# EAGLE design AC (EAGLE 7.1.0)
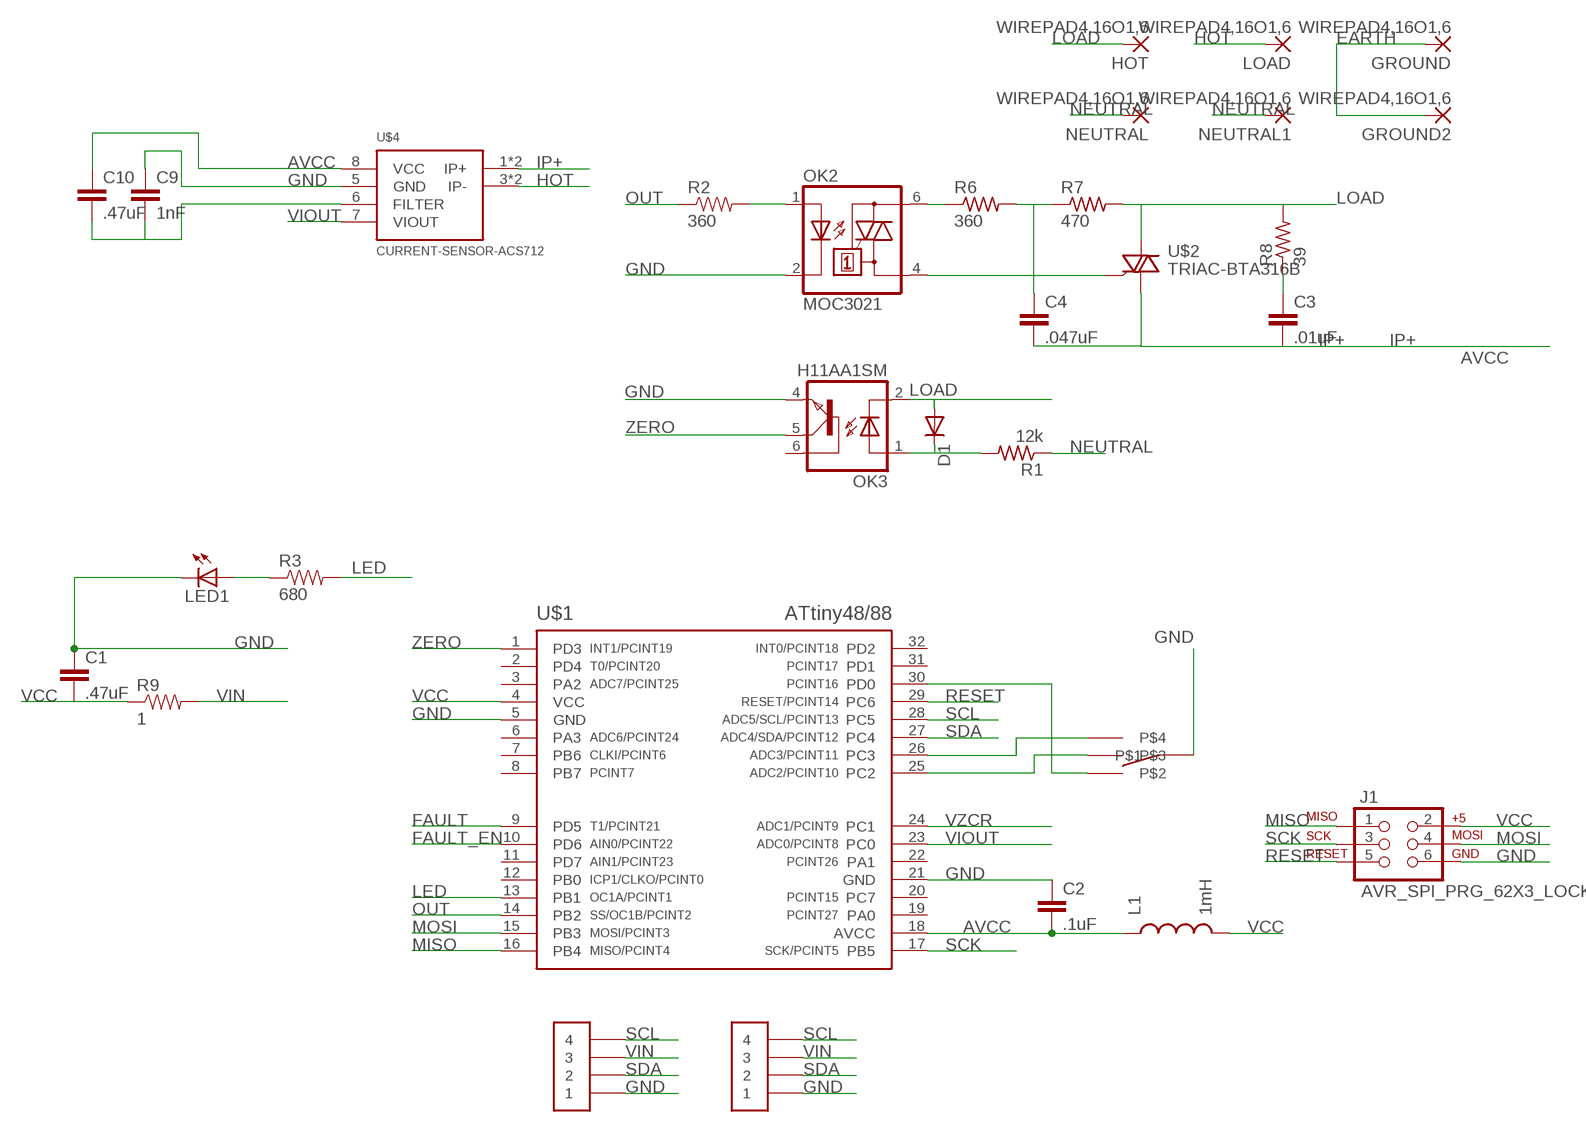
[diagram p0: schematic, sheet 1]

## Parts
C1  .47uF  CAP0805  [0805]
C2  .1uF  CAP0805  [0805]
C3  .01uF  C-EUC1206  [C1206]
C4  .047uF  C-EUC1206  [C1206]
C9  1nF  CAP0805  [0805]
C10  .47uF  CAP0805  [0805]
D1  DIODESMA  [SMA-DIODE]
GROUND  WIREPAD4,16O1,6  [4,16O1,6]
GROUND2  WIREPAD4,16O1,6  [4,16O1,6]
HOT  WIREPAD4,16O1,6  [4,16O1,6]
J1  AVR_SPI_PRG_62X3_LOCK  [2X3_LOCK]
JP1  HEADER-1X4MOLEX-SL  [HEADER-1X4-MOLEX-SL]
JP2  HEADER-1X4MOLEX-SL  [HEADER-1X4-MOLEX-SL]
L1  1mH  INDUCTOR1007  [1007]
LED1  LED5MM  [LED5MM]
LOAD  WIREPAD4,16O1,6  [4,16O1,6]
NEUTRAL  WIREPAD4,16O1,6  [4,16O1,6]
NEUTRAL1  WIREPAD4,16O1,6  [4,16O1,6]
OK2  MOC3021  MOC3031S  [DIL6-SMD]
OK3  H11AA1SM  H11A1SM  [DIL6-SMD]
R1  12k  R-US_R1206  [R1206]
R2  360  RESISTOR0805-RES  [0805]
R3  680  RESISTOR0805-RES  [0805]
R6  360  R-US_R1206  [R1206]
R7  470  R-US_R1206  [R1206]
R8  39  R-US_R1206  [R1206]
R9  1  RESISTOR0805-RES  [0805]
U$1  ATTINY48/88-TQFP  [TQFP-32]
U$2  TRIAC-BTA316B  [D2PACK]
U$3  SWITCH-SP3T  [SWITCH-SLIDE-APEM-MHS133K]
U$4  CURRENT-SENSOR-ACS712  [SOIC-8]

## Nets
AVCC: C2.2 C10.1 L1.1 U$1.18(AVCC) U$4.8(VCC)
EARTH: GROUND2.1(P) GROUND.1(P)
FAULT: U$1.9(PD5)
FAULT_EN: U$1.10(PD6)
GND: C1.1 C2.1 C9.1 J1.6 JP1.P$1 JP2.P$1 LED1.K(C) OK2.2(C) OK3.4(EMI) U$1.5(GND) U$1.21(GND) U$3.P2 U$4.5(GND)
HOT: LOAD.1(P) U$4.3(IP-) U$4.4(IP-)
IP+: C3.2 C4.2 U$2.1(A1) U$4.1(IP+) U$4.2(IP+)
LED: R3.2 U$1.13(PB1)
LOAD: D1.A HOT.1(P) OK3.2(C) R7.2 R8.2 U$2.2(A2)
MISO: J1.1 U$1.16(PB4)
MOSI: J1.4 U$1.15(PB3)
N$1: OK2.4(A1) U$2.3(G)
N$2: D1.C OK3.1(A) R1.2
N$3: OK2.1(A) R2.2
N$4: OK2.6(A2) R6.1
N$5: LED1.A R3.1
N$7: U$1.25(PC2) U$3.P3
N$8: U$1.26(PC3) U$3.P4
N$9: U$1.30(PD0) U$3.P1
N$12: C9.2 C10.2 U$4.6(FILTER)
N$13: C4.1 R6.2 R7.1
N$14: C3.1 R8.1
NEUTRAL: NEUTRAL1.1(P) NEUTRAL.1(P) R1.1
OUT: R2.1 U$1.14(PB2)
RESET: J1.5 U$1.29(PC6)
SCK: J1.3 U$1.17(PB5)
SCL: JP1.P$4 JP2.P$4 U$1.28(PC5)
SDA: JP1.P$2 JP2.P$2 U$1.27(PC4)
VCC: C1.2 J1.2 L1.2 R9.1 U$1.4(VCC)
VIN: JP1.P$3 JP2.P$3 R9.2
VIOUT: U$1.23(PC0) U$4.7(VIOUT)
VZCR: U$1.24(PC1)
ZERO: OK3.5(COL) U$1.1(PD3)
Unconnected: OK3.6(BAS) U$1.2(PD4) U$1.3(PA2) U$1.6(PA3) U$1.7(PB6) U$1.8(PB7) U$1.11(PD7) U$1.12(PB0) U$1.19(PA0) U$1.20(PC7) U$1.22(PA1) U$1.31(PD1) U$1.32(PD2)

## Library data of the parts
C1 C2 C9 C10 = SparkFun-Capacitors:CAP: Capacitor Standard 0603 ceramic capacitor, and 0.1" leaded capacitor.
C3 C4 = resistor:C-EU: CAPACITOR, European symbol; SPICEPREFIX: C
D1 = SparkFun-DiscreteSemi:DIODE: Diode These are standard reverse protection diodes and small signal diodes. SMA package can handle up to about 1A. SOD-323 can handle about 200mA. What the SOD-323 package when ordering, there are some mfgs out there that are 5-pin packages.
GROUND GROUND2 HOT LOAD NEUTRAL NEUTRAL1 = wirepad:WIREPAD: Wire PAD connect wire on PCB
J1 = SparkFun-Connectors:AVR_SPI_PRG_6: AVR ISP 6 Pin This is the reduced ISP connector for AVR programming. Common on Arduino. This footprint will take up less PCB space and can be used with a 10-pin to 6-pin adapter such as SKU: BOB-08508
JP1 JP2 = IntegerLabs:HEADER-1X4
L1 = SparkFun-Passives:INDUCTOR: Inductors Basic Inductor/Choke - 0603 and 1206. Footprints are not proven and vary greatly between part numbers. SRN6045- 33uH, 20% 1.4A SDR0403-560KL - 56uH, 10%, 500mA RMS/740mA peak
LED1 = adafruit:LED: LED OSRAM: - CHIPLED LG R971, LG N971, LY N971, LG Q971, LY Q971, LO R971, LY R971 LH N974, LH R974 LS Q976, LO Q976, LY Q976 LO Q996 - Hyper CHIPLED LW Q18S LB Q993, LB Q99A, LB R99A - SideLED LS A670, LO A670, LY A670, LG A670, LP A670 LB A673, LV A673, LT A673, LW A673 LH A674 LY A675 LS A676, LA A676, LO A676, LY A676, LW A676 LS A679, LY A679, LG A679 - Hyper Micro SIDELED® LS Y876, LA Y876, LO Y876, LY Y876 LT Y87S - SmartLED LW L88C, LW L88S LB L89C, LB L89S, LG L890 LS L89K, LO L89K, LY L89K LS L896, LA L896, LO L896, LY L896 - TOPLED LS T670, LO T670, LY T670, LG T670, LP T670 LSG T670, LSP T670, LSY T670, LOP T670, LYG T670 LG T671, LOG T671, LSG T671 LB T673, LV T673, LT T673, LW T673 LH T674 LS T676, LA T676, LO T676, LY T676, LB T676, LH T676, LSB T676, LW T676 LB T67C, LV T67C, LT T67C, LS T67K, LO T67K, LY T67K, LW E67C LS E67B, LA E67B, LO E67B, LY E67B, LB E67C, LV E67C, LT E67C LW T67C LS T679, LY T679, LG T679 LS T770, LO T770, LY T770, LG T770, LP T770 LB T773, LV T773, LT T773, LW T773 LH T774 LS E675, LA E675, LY E675, LS T675 LS T776, LA T776, LO T776, LY T776, LB T776 LHGB T686 LT T68C, LB T68C - Hyper Mini TOPLED® LB M676 - Mini TOPLED Santana® LG M470 LS M47K, LO M47K, LY M47K Source: http://www.osram.convergy.de/
OK2 = optocoupler:MOC30*: 6-Pin DIP Zero-Cross Optoisolators Triac Driver Output (250/400 Volt Peak) Source: Data sheet <http://www.fairchildsemi.com/ds/MO/MOC3031M.pdf> The old path of data sheet not more available 2013-05-06.; MF: FAIRCHILD SEMICONDUCTOR; MPN: MOC3031SM; OC_FARNELL: unknown; OC_NEWARK: 34C1335
OK3 = optocoupler:H11A*?M: General Purpose 6-Pin Phototransistor Optocouplers Source: http://www.fairchildsemi.com/ds/4N/4N35-M.pdf; OC_FARNELL: unknown; OC_NEWARK: unknown
R1 R6-R8 = resistor:R-US_: RESISTOR, American symbol
R2 R9 = SparkFun-Resistors:RESISTOR: Resistor Basic schematic elements and footprints for 0603, 1206, and PTH resistors.
R3 = SparkFun-Passives:RESISTOR: Resistor Basic schematic elements and footprints for 0603, 1206, and PTH resistors.
U$1 = IntegerLabs:ATTINY48/88
U$2 = IntegerLabs:TRIAC-BTA316B
U$3 = IntegerLabs:SWITCH-SP3T
U$4 = IntegerLabs:CURRENT-SENSOR-ACS712

## Board
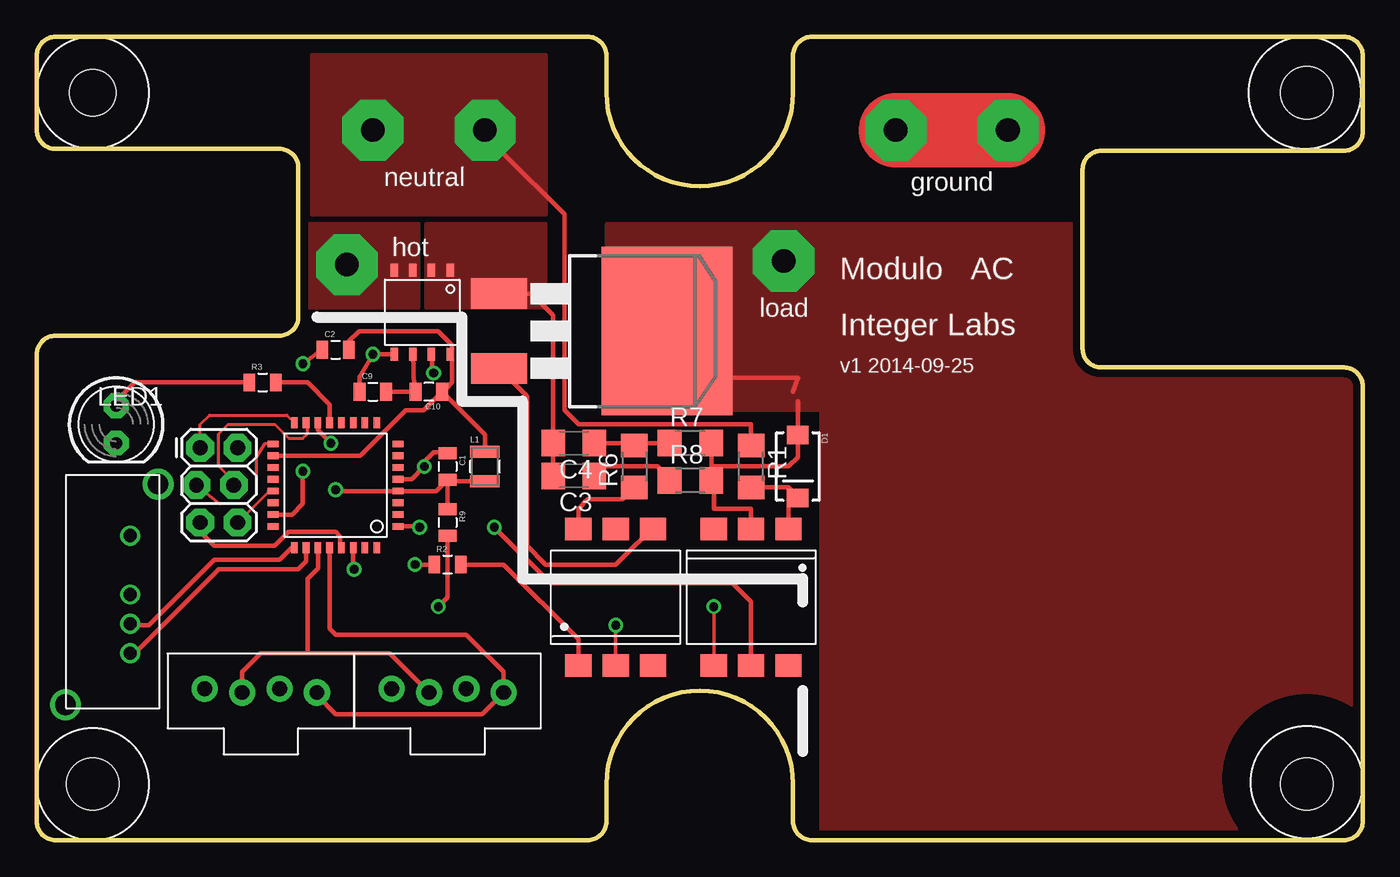
[diagram p1: board, top side]
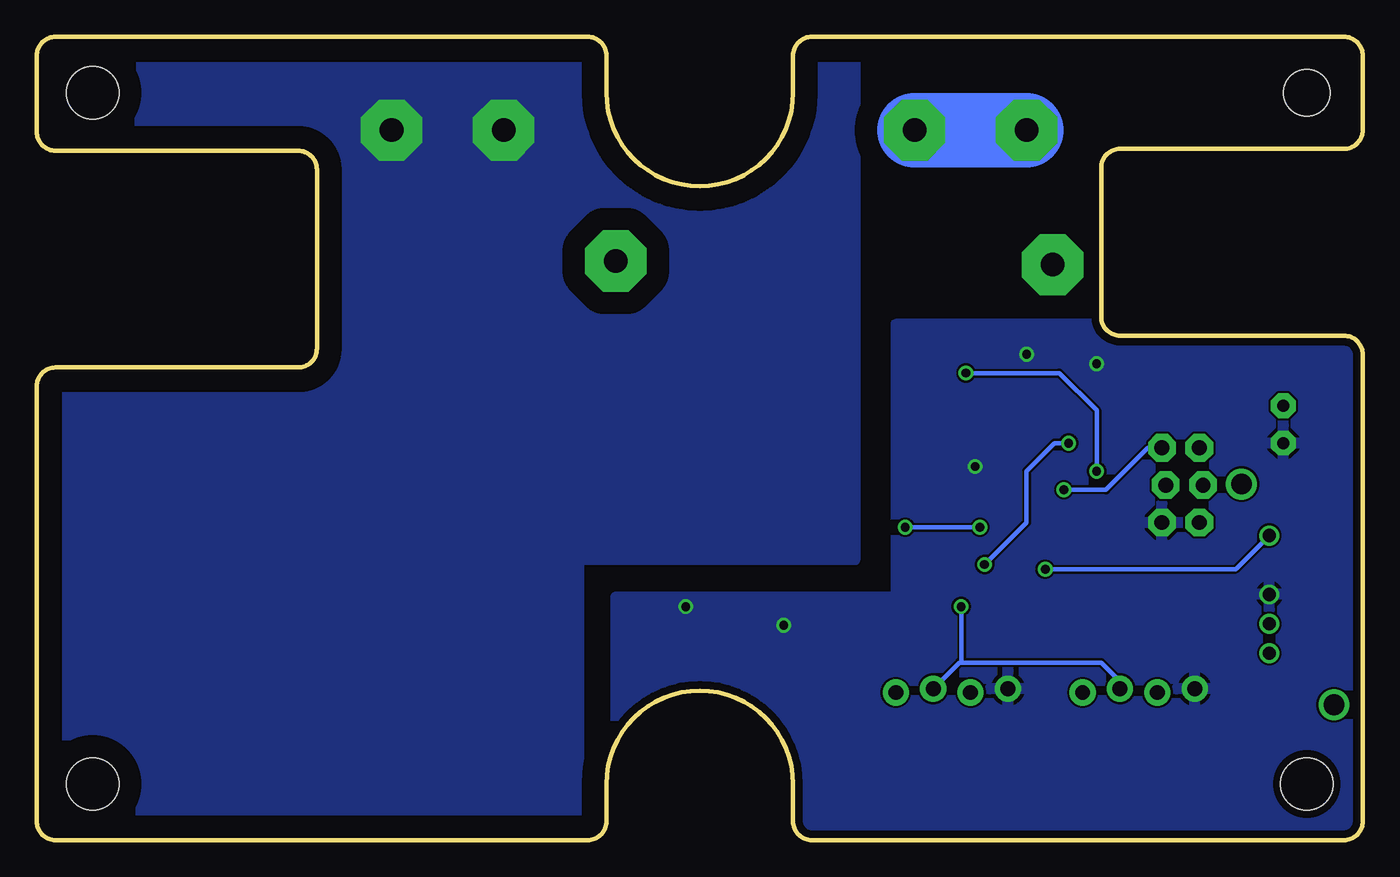
[diagram p2: board, bottom side, seen from below]

Size 90.17 x 54.61 mm. Coordinates in mm from the lower left corner, seen from the top.
Outline: 16.51,34.29 1.27,34.29 arc90 0,33.02 0,1.27 arc90 1.27,0 37.47,0 arc90 38.73,1.27 38.73,3.81 arc-180 51.44,3.81 51.44,1.27 arc90 52.7,0 88.9,0 arc90 90.17,1.27 90.17,30.86 arc90 88.9,32.13 72.39,32.13 arc-90 71.12,33.4 71.12,45.59 arc-90 72.39,46.86 88.9,46.86 arc90 90.17,48.13 90.17,53.34 arc90 88.9,54.61 52.7,54.61 arc90 51.44,53.34 51.44,50.8 arc-180 38.73,50.8 38.73,53.34 arc90 37.47,54.61 1.27,54.61 arc90 0,53.34 0,48.26 arc90 1.27,46.99 16.51,46.99 arc-90 17.78,45.72 17.78,35.56 arc-90 16.51,34.29
Copper layers (1*16): Top 0.0178mm / dielectric 59mil / Bottom 0.0178mm
Design rules "SSC-EAGLE-2Lyr_v1.0.0.3": minimum track width 6mil, minimum drill 14mil, track to track 6mil, track to pad 6mil, pad to pad 6mil, via to via 6mil, smd to smd 6mil, copper to edge 20mil, drill to drill 16mil, minimum pad ring 8mil, minimum via ring 8mil, stop-mask expansion 3mil, vias tented up to drill 0mil, thermal gap 10mil
Holes 3.56 mm at 3.81,3.81 86.36,50.8 86.36,3.81
Holes 3.17 mm at 3.81,50.8
tRestrict: area 81.3,-0.9 to 91.4,9.2

### Footprints (pad centres in the part's own frame; a part is rotated, then mirrored left to right if it is on the bottom)
0805 = smd 0.8 x 1.2: 1 -0.9,0; 2 0.9,0
C1206 = smd 1.6 x 1.8: 1 -1.4,0; 2 1.4,0
SMA-DIODE = smd 1.27 x 1.47: A -2.15,0; C 2.15,0
4,16O1,6 = drill 1.6 pad 4.166 octagon: 1 0,0
2X3_LOCK = drill 1.016 pad 1.88 octagon: 1 0,0; 2 0,2.54; 3 2.54,-0.254; 4 2.54,2.286; 5 5.08,0; 6 5.08,2.54
HEADER-1X4-MOLEX-SL = drill 1.016 pad 1.778: P$1 -3.81,0.127; P$2 -1.27,-0.127; P$3 1.27,0.127; P$4 3.81,-0.127
1007 = smd 2 x 0.8: 1 0,1; 2 0,-1
LED5MM = drill 0.813 pad 1.676 octagon: A -1.27,0; K 1.27,0
DIL6-SMD = smd 1.78 x 1.52: 1 -2.54,-4.645; 2 0,-4.645; 3 2.54,-4.645; 4 2.54,4.645; 5 0,4.645; 6 -2.54,4.645
R1206 = smd 1.6 x 1.803: 1 -1.422,0; 2 1.422,0
TQFP-32 = smd 0.75 x 0.45: 1 -4.25,2.8; 2 -4.25,2; 3 -4.25,1.2; 4 -4.25,0.4; 5 -4.25,-0.4; 6 -4.25,-1.2; 7 -4.25,-2; 8 -4.25,-2.8; 17 4.25,-2.8; 18 4.25,-2; 19 4.25,-1.2; 20 4.25,-0.4; 21 4.25,0.4; 22 4.25,1.2; 23 4.25,2; 24 4.25,2.8 | smd 0.45 x 0.75: 9 -2.8,-4.25; 10 -2,-4.25; 11 -1.2,-4.25; 12 -0.4,-4.25; 13 0.4,-4.25; 14 1.2,-4.25; 15 2,-4.25; 16 2.8,-4.25; 25 2.8,4.25; 26 2,4.25; 27 1.2,4.25; 28 0.4,4.25; 29 -0.4,4.25; 30 -1.2,4.25; 31 -2,4.25; 32 -2.8,4.25
D2PACK = smd 2.083 x 3.81: 1 -2.54,-8.89; 3 2.54,-8.89 | smd 11.43 x 8.89: 2 0,2.54
SWITCH-SLIDE-APEM-MHS133K = drill 0.9: P1 0,8; P2 0,4; P3 0,2; P4 0,0 | drill 1.4: P5 -4.4,-3.5; P6 1.9,11.5
SOIC-8 = smd 0.508 x 0.889: 1 -1.27,-3.175; 2 0,-3.175; 3 1.27,-3.175; 4 2.54,-3.175; 5 2.54,2.54; 6 1.27,2.54; 7 0,2.54; 8 -1.27,2.54

### Placement (x,y rotation side)
C1  27.94,25.4 270 top
C2  20.32,33.34 0 top
C3  36.51,24.77 180 top
C4  36.51,26.99 180 top
C9  22.86,30.48 0 top
C10  26.67,30.48 180 top
D1  51.75,25.4 270 top
GROUND  66.04,48.26 0 top
GROUND2  58.42,48.26 0 top
HOT  50.8,39.37 0 top
J1  11.11,26.67 270 top
JP1  15.24,10.16 0 top
JP2  27.94,10.16 0 top
L1  30.48,25.4 0 top
LED1  5.4,28.26 270 top
LOAD  21.08,39.12 0 top
NEUTRAL  22.86,48.26 0 top
NEUTRAL1  30.48,48.26 0 top
OK2  39.37,16.51 0 top
OK3  48.58,16.51 180 top
R1  48.58,25.4 270 top
R2  27.94,18.73 0 top
R3  15.37,31.11 0 top
R6  40.64,25.4 90 top
R7  44.45,26.99 0 top
R8  44.45,24.45 0 top
R9  27.94,21.59 270 top
U$1  20.32,24.13 180 top
U$2  40.32,34.61 270 top
U$3  6.35,12.7 0 top
U$4  26.85,35.56 180 top

### Tracks (layer width: path | path; a pad name or v marks a point on that pad's centre or on a via)
AVCC
  Top 0.318: C10.1 27.82,30.73 27.88,30.73 28.26,31.11 28.26,32.88 U$4.8 28.26,33.16 28.26,33.66 27.3,34.61 21.91,34.61 21.22,33.92 C2.2 | L1.1 30.48,27.57 C10.1 | U$1.18 22,26.13 25.08,29.21 26.3,29.21 C10.1
EARTH
  Top 5.08: GROUND2.1 GROUND.1
  pour Bottom (isolate 1.524, no thermals): 34.54,53.34 34.54,19.05 53.34,19.05 53.34,0 88.9,0 88.9,53.34
GND  (via drill 0.6)
  Top 0.203: 15.79,23.73 J1.6
  Top 0.254: OK2.2 v39.37,14.61 | OK3.4 v46.04,15.88
  Top 0.318: 21.91,30.53 C9.1 21.96,31.48 v22.86,33.02 U$4.5 | 27.89,26.3 C1.1 27.89,26.35 26.99,26.35 26.35,25.72 v26.35,25.4 25.48,24.53 U$1.5 24.65,24.45 | C2.1 v18.1,32.38 | U$1.21 15.79,23.73
  pour Bottom: -2.54,-2.54 -2.54,59.69 13.97,59.69 13.97,35.05 31.75,35.05 31.75,16.51 50.8,16.51 50.8,-2.54
HOT
  pour Top (no thermals): 25.97,36.2 18.48,36.2 18.48,41.91 25.97,41.91
IP+
  Top 0.318: C3.2 C4.2 35.11,35.69 33.66,37.15 U$2.1
  pour Top (no thermals): 26.48,41.91 26.48,36.2 34.61,36.2 34.61,41.91
LED
  Top 0.318: U$1.13 19.92,29.61 18.41,31.11 R3.2
LOAD
  Top 0.318: 39.05,30.48 39.05,30.8 U$2.2 45.4,32.07 45.4,30.48 46.99,31.43 51.75,31.43 51.44,30.48 | OK3.2 48.58,22.54 46.04,22.54 46.04,24.28 R8.2 45.87,25.4 | 45.87,25.4 R7.2 | 45.87,25.4 51.12,25.4 51.75,26.04 D1.A 51.75,29.84
  pour Top (isolate 0.508, no thermals): 53.34,29.21 53.34,0 90.17,0 90.3,41.91 38.73,41.91 38.73,29.21
MISO
  Top 0.203: J1.1 11.11,28.26 11.75,28.89 17.01,28.89 U$1.16
MOSI
  Top 0.203: J1.4 13.4,24.38 12.38,25.4 12.38,27.62 13.02,28.26 16.19,28.26 17.14,27.3 18.1,27.3 18.41,27.62 18.41,28.29 U$1.15
N$1
  Top 0.318: OK2.4 40.64,20 39.37,18.73 34.61,18.73 33.34,20 33.34,30.16 U$2.3
N$2
  Top 0.318: OK3.1 51.12,23.98 | 51.12,23.98 R1.2 | D1.C 51.75,23.34 51.12,23.98
N$3
  Top 0.318: OK2.1 36.83,13.65 31.75,18.73 R2.2
N$4
  Top 0.318: OK2.6 36.83,22.54 37.47,23.18 39.84,23.18 R6.1
N$5
  Top 0.318: LED1.A 5.4,29.84 6.67,31.11 R3.1
N$7
  Top 0.318: U$1.25 17.34,19.88 16.51,19.05 12.06,19.05 7.62,14.61 6.45,14.61 U$3.P3
N$8
  Top 0.318: U$1.26 18.32,18.95 17.78,18.41 12.38,18.41 6.67,12.7 U$3.P4
N$9  (via drill 0.6)
  Top 0.318: U$1.30 21.52,18.48 v21.59,18.41
  Bottom 0.318: v21.59,18.41 8.63,18.41 U$3.P1
N$12
  Top 0.318: U$4.6 25.65,30.76 arc45 C10.2 C9.2
N$13
  Top 0.318: C4.1 40.47,26.99 R6.2 40.81,26.99 R7.1
N$14
  Top 0.318: R8.1 43.03,24.6 42.23,25.4 38.55,25.4 C3.1
NEUTRAL
  Top 0.318: NEUTRAL1.1 31.75,46.67 35.88,42.55 35.88,29.21 36.83,28.26 48.58,28.26 R1.1
  Bottom 5.08: NEUTRAL1.1 NEUTRAL.1
  pour Top (no thermals): 18.73,53.34 18.73,42.55 34.61,42.55 34.61,53.34
OUT  (via drill 0.6)
  Top 0.318: U$1.14 19.12,27.87 v20,26.99 | R2.1 v25.72,18.73
  Bottom 0.318: v20,26.99 20.95,26.99 22.86,25.08 22.86,21.59 v25.72,18.73
RESET
  Top 0.318: J1.5 11.11,20.95 12.06,20 16.19,20 17.14,20.95 20.32,20.95 20.64,20.64 20.64,19.96 U$1.29
SCK
  Top 0.203: U$1.17 15.5,26.93 14.92,26.04 14.92,23.5 14.29,22.86 12.45,22.86 J1.3
SCL
  Top 0.318: U$1.28 19.92,14.37 20.32,13.97 29.21,13.97 31.75,11.43 JP2.P$4 30.29,8.57 20.32,8.57 19.05,9.84 JP1.P$4
SDA
  Top 0.318: JP1.P$2 13.97,11.43 15.24,12.7 18.41,12.7 | 18.41,12.7 24,12.7 JP2.P$2 | U$1.27 19.12,18.48 18.41,17.78 18.41,12.7
VCC  (via drill 0.6)
  Top 0.318: C1.2 27.17,23.73 U$1.4 20.4,23.73 v20.32,23.81 | L1.2 28.04,24.4 C1.2 | C1.2 R9.1
  Bottom 0.318: J1.2 14.61,26.67 17.46,23.81 v20.32,23.81
VIN  (via drill 0.6)
  Top 0.318: R9.2 27.94,16.51 v27.3,15.88
  Bottom 0.318: JP1.P$3 16.51,10.79 17.78,12.06 27.3,12.06 | 27.3,12.06 27.43,12.06 JP2.P$3 | v27.3,15.88 27.3,12.06
VIOUT  (via drill 0.6)
  Top 0.318: U$4.7 26.92,31.81 v26.99,31.75 | U$1.23 17.37,22.13 18.1,22.86 v18.1,25.08
  Bottom 0.318: v26.99,31.75 20.64,31.75 18.1,29.21 v18.1,25.08
ZERO  (via drill 0.6)
  Top 0.318: OK3.5 48.58,16.19 47.31,17.46 34.92,17.46 v31.11,21.27 | U$1.1 25.98,21.33 v26.04,21.27
  Bottom 0.318: v31.11,21.27 v26.04,21.27

### Text on the board
tPlace: neutral | ground | hot | Modulo | AC | load | Integer Labs | v1 2014-09-25